# EAGLE design Mega2560 SX Shield (EAGLE 9.6.2)
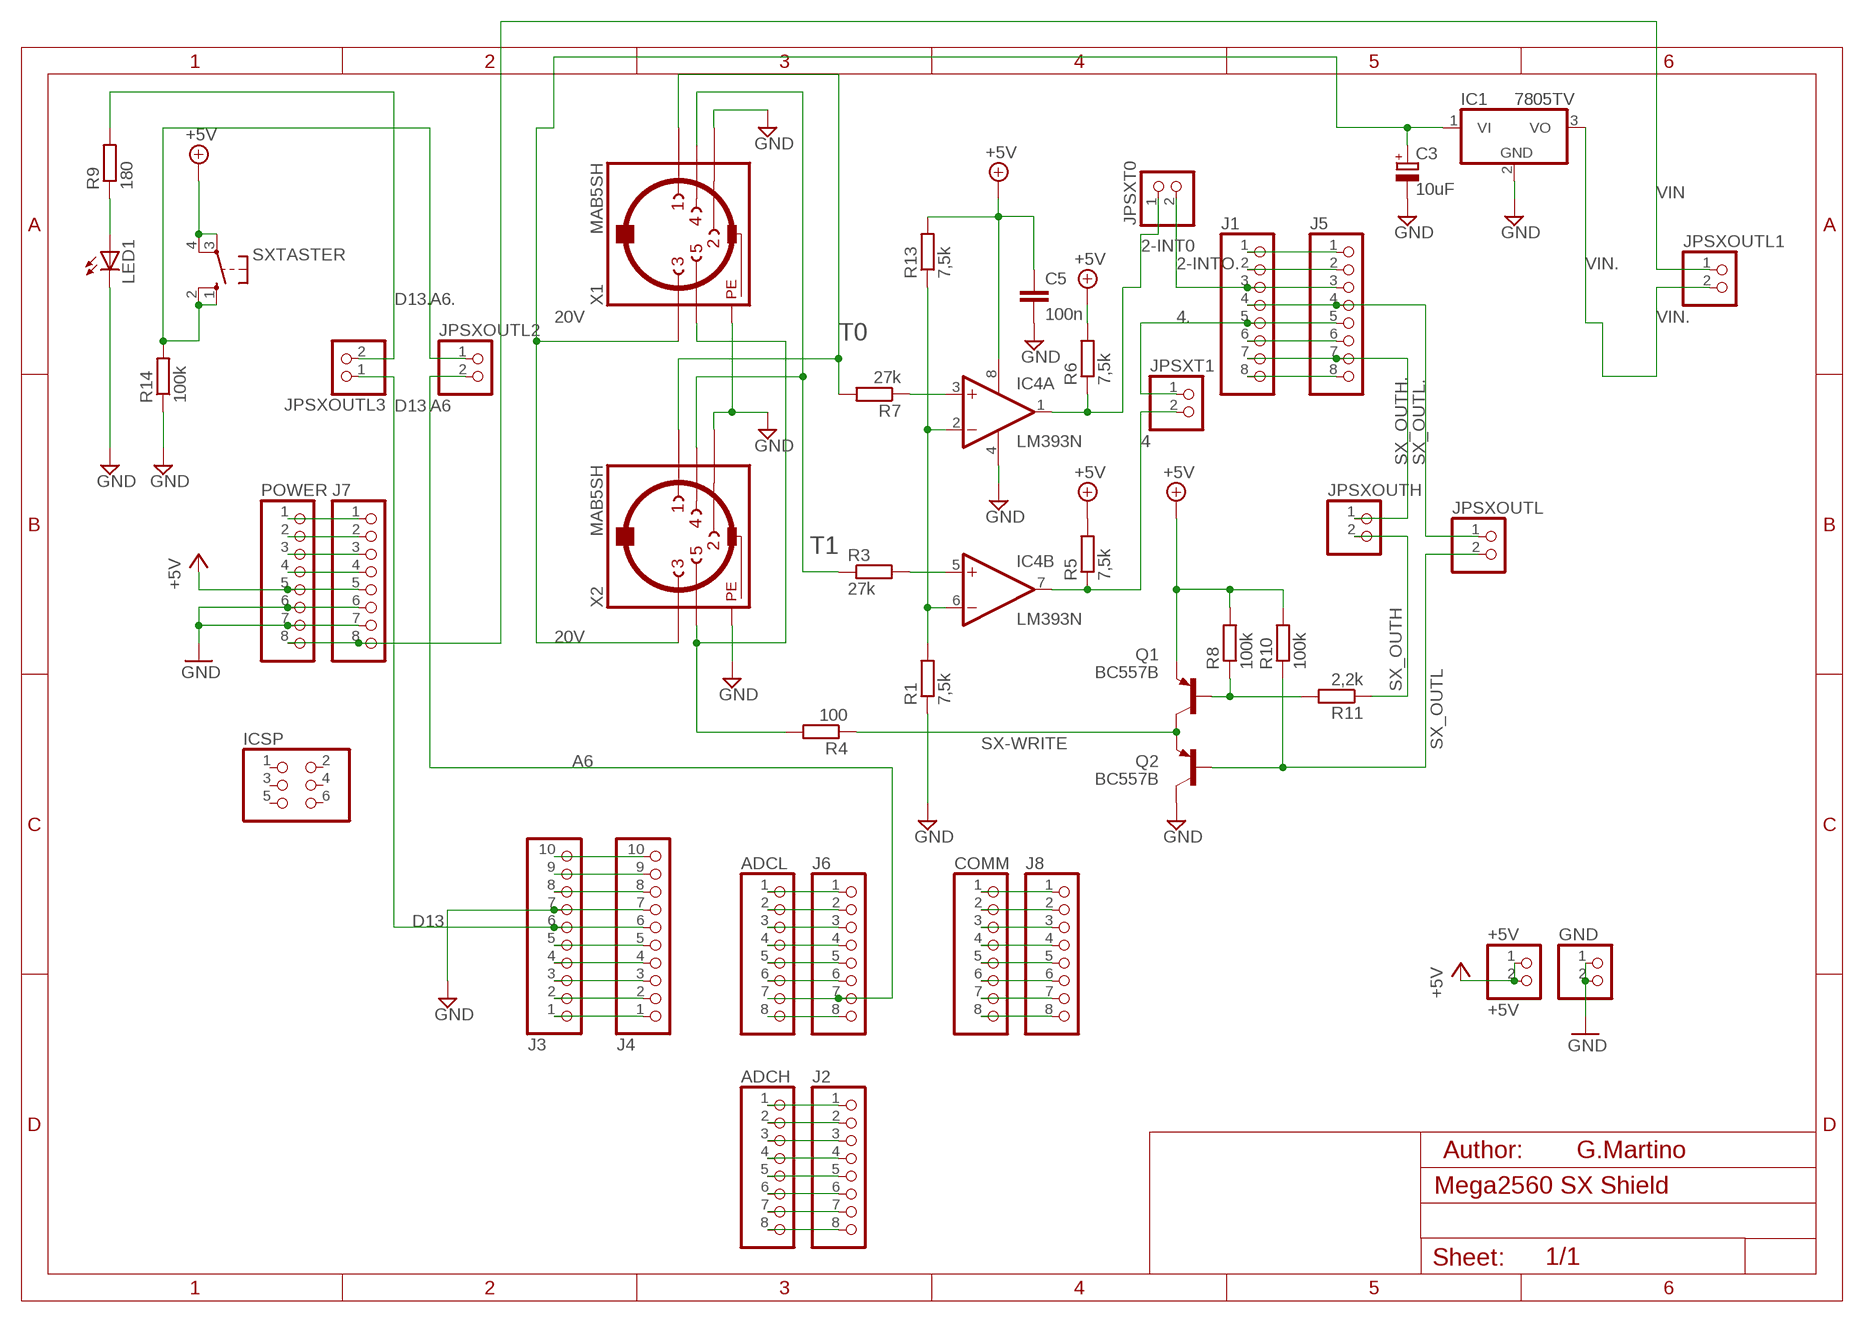
[diagram p0: schematic, sheet 1]

## Parts
+5V  +5V  PINHD-1X2  [1X02]
ADCH  PINHD-1X8TH  [1X08-TH]
ADCL  PINHD-1X8TH  [1X08-TH]
C3  10uF  CPOL-EUTT2D5  [TT2D5]
C5  100n  C-EU050-025X075  [C050-025X075]
COMM  PINHD-1X8TH  [1X08-TH]
GND  PINHD-1X2  [1X02]
IC1  7805TV  [TO220V]
IC4  LM393N  [DIL08]
ICSP  PINHD-2X3  [2X03]
J1  PINHD-1X8TH  [1X08-TH]
J2  PINHD-1X8TH  [1X08-TH]
J3  PINHD-1X10TH  [1X10-TH]
J4  PINHD-1X10TH  [1X10-TH]
J5  PINHD-1X8TH  [1X08-TH]
J6  PINHD-1X8TH  [1X08-TH]
J7  PINHD-1X8TH  [1X08-TH]
J8  PINHD-1X8TH  [1X08-TH]
JPSXOUTH  PINHD-1X2  [1X02]
JPSXOUTL  PINHD-1X2  [1X02]
JPSXOUTL1  PINHD-1X2  [1X02]
JPSXOUTL2  PINHD-1X2  [1X02]
JPSXOUTL3  PINHD-1X2  [1X02]
JPSXT0  PINHD-1X2  [1X02]
JPSXT1  PINHD-1X2  [1X02]
LED1  LED3MM  [LED3MM]
POWER  PINHD-1X8TH  [1X08-TH]
Q1  BC557B  [TO92-EBC]
Q2  BC557B  [TO92-EBC]
R1  7,5k  R-EU_0207/10  [0207/10]
R3  27k  R-EU_0207/10  [0207/10]
R4  100  R-EU_0207/10  [0207/10]
R5  7,5k  R-EU_0207/10  [0207/10]
R6  7,5k  R-EU_0207/10  [0207/10]
R7  27k  R-EU_0207/10  [0207/10]
R8  100k  R-EU_0207/10  [0207/10]
R9  180  R-EU_0207/10  [0207/10]
R10  100k  R-EU_0207/10  [0207/10]
R11  2,2k  R-EU_0207/10  [0207/10]
R13  7,5k  R-EU_0207/10  [0207/10]
R14  100k  R-EU_0207/10  [0207/10]
SXTASTER  10-XX  [B3F-10XX]
X1  MAB5SH  [MAB5SH]
X2  MAB5SH  [MAB5SH]

## Nets
2-INT0: IC4.1(A:OUT) JPSXT0.1 R6.1
2-INTO.: J1.3 J5.3 JPSXT0.2
4: IC4.7(B:OUT) JPSXT1.2 R5.1
4.: J1.5 J5.5 JPSXT1.1
20V: C3.+ IC1.1(VI) X1.3 X2.3
+5V: +5V.1 +5V.2 C5.1 IC4.8(P:V+) J7.5 POWER.5 Q1.E R5.2 R6.2 R8.2 R10.2 R13.2 SXTASTER.3(P) SXTASTER.4(P1)
A6: ADCL.7 J6.7 JPSXOUTL2.2
A6.: JPSXOUTL2.1 R14.2 SXTASTER.1(S) SXTASTER.2(S1)
D13: J3.6 J4.6 JPSXOUTL3.1
D13.: JPSXOUTL3.2 R9.2
GND: C3.- C5.2 GND.1 GND.2 IC1.2(GND) IC4.4(P:V-) J3.7 J4.7 J7.6 J7.7 LED1.K(C) POWER.6 POWER.7 Q2.C R1.1 R14.1 X1.2 X1.PE X1.PE@1(PE) X1.PE@2(PE) X1.PE@(PE) X2.2 X2.PE X2.PE@1(PE) X2.PE@2(PE) X2.PE@(PE)
N$1: IC4.3(A:+IN) R7.1
N$2: J3.1 J4.1
N$4: J1.2 J5.2
N$5: J3.4 J4.4
N$6: J3.2 J4.2
N$7: J3.3 J4.3
N$8: J1.1 J5.1
N$13: J1.6 J5.6
N$15: J1.8 J5.8
N$18: ADCL.1 J6.1
N$19: ADCL.2 J6.2
N$20: ADCL.3 J6.3
N$21: ADCL.4 J6.4
N$22: ADCL.5 J6.5
N$23: ADCL.6 J6.6
N$63: ADCL.8 J6.8
N$64: ADCH.1 J2.1
N$88: ADCH.2 J2.2
N$89: ADCH.3 J2.3
N$116: ADCH.4 J2.4
N$121: ADCH.5 J2.5
N$124: ADCH.6 J2.6
N$125: J7.4 POWER.4
N$126: J3.9 J4.9
N$127: ADCH.7 J2.7
N$128: ADCH.8 J2.8
N$129: COMM.1 J8.1
N$130: COMM.2 J8.2
N$133: COMM.3 J8.3
N$134: COMM.4 J8.4
N$136: COMM.5 J8.5
N$137: COMM.6 J8.6
N$138: COMM.7 J8.7
N$139: COMM.8 J8.8
N$140: J3.5 J4.5
N$219: J7.2 POWER.2
N$220: J7.1 POWER.1
N$222: J3.8 J4.8
N$223: J3.10 J4.10
N$338: IC4.5(B:+IN) R3.2
N$339: IC4.2(A:-IN) IC4.6(B:-IN) R1.2 R13.1
N$451: R4.2 X1.5 X2.5
N$452: LED1.A R9.1
N$481: Q1.B R8.1 R11.2
RESET: J7.3 POWER.3
SX-WRITE: Q1.C Q2.E R4.1
SX_OUTH: JPSXOUTH.2 R11.1
SX_OUTH.: J1.7 J5.7 JPSXOUTH.1
SX_OUTL: JPSXOUTL.2 Q2.B R10.1
SX_OUTL.: J1.4 J5.4 JPSXOUTL.1
T0: R7.2 X1.1 X2.1
T1: R3.1 X1.4 X2.4
VIN: J7.8 JPSXOUTL1.1 POWER.8
VIN.: IC1.3(VO) JPSXOUTL1.2
Unconnected: ICSP.1 ICSP.2 ICSP.3 ICSP.4 ICSP.5 ICSP.6

## Notes on the sheet
- G.Martino

## Library data of the parts
+5V GND JPSXOUTH JPSXOUTL JPSXOUTL1-JPSXOUTL3 JPSXT0 JPSXT1 = pinhead:PINHD-1X2: PIN HEADER
ADCH ADCL COMM J1 J2 J5-J8 POWER = Smartprj:PINHD-1X8: PIN HEADER
C3 = rcl:CPOL-EU: POLARIZED CAPACITOR, European symbol; SPICEPREFIX: C
C5 = rcl:C-EU: CAPACITOR, European symbol
IC1 = linear:78*: Positive VOLTAGE REGULATOR Source: http://cache.national.com/ds/LM/LM78L05.pdf http://www.fairchildsemi.com/ds/LM/LM7805.pdf
IC4 = linear:LM393: COMPARATOR
ICSP = Smartprj:PINHD-2X3: PIN HEADER
J3 J4 = Smartprj:PINHD-1X10: PIN HEADER
LED1 = led:LED: LED OSRAM: - CHIPLED LG R971, LG N971, LY N971, LG Q971, LY Q971, LO R971, LY R971 LH N974, LH R974 LS Q976, LO Q976, LY Q976 LO Q996 - Hyper CHIPLED LW Q18S LB Q993, LB Q99A, LB R99A - SideLED LS A670, LO A670, LY A670, LG A670, LP A670 LB A673, LV A673, LT A673, LW A673 LH A674 LY A675 LS A676, LA A676, LO A676, LY A676, LW A676 LS A679, LY A679, LG A679 - Hyper Micro SIDELED® LS Y876, LA Y876, LO Y876, LY Y876 LT Y87S - SmartLED LW L88C, LW L88S LB L89C, LB L89S, LG L890 LS L89K, LO L89K, LY L89K LS L896, LA L896, LO L896, LY L896 - TOPLED LS T670, LO T670, LY T670, LG T670, LP T670 LSG T670, LSP T670, LSY T670, LOP T670, LYG T670 LG T671, LOG T671, LSG T671 LB T673, LV T673, LT T673, LW T673 LH T674 LS T676, LA T676, LO T676, LY T676, LB T676, LH T676, LSB T676, LW T676 LB T67C, LV T67C, LT T67C, LS T67K, LO T67K, LY T67K, LW E67C LS E67B, LA E67B, LO E67B, LY E67B, LB E67C, LV E67C, LT E67C LW T67C LS T679, LY T679, LG T679 LS T770, LO T770, LY T770, LG T770, LP T770 LB T773, LV T773, LT T773, LW T773 LH T774 LS E675, LA E675, LY E675, LS T675 LS T776, LA T776, LO T776, LY T776, LB T776 LHGB T686 LT T68C, LB T68C - Hyper Mini TOPLED® LB M676 - Mini TOPLED Santana® LG M470 LS M47K, LO M47K, LY M47K Source: http://www.osram.convergy.de LUXEON: - LUMILED® LXK2-PW12-R00, LXK2-PW12-S00, LXK2-PW14-U00, LXK2-PW14-V00 LXK2-PM12-R00, LXK2-PM12-S00, LXK2-PM14-U00 LXK2-PE12-Q00, LXK2-PE12-R00, LXK2-PE12-S00, LXK2-PE14-T00, LXK2-PE14-U00 LXK2-PB12-K00, LXK2-PB12-L00, LXK2-PB12-M00, LXK2-PB14-N00, LXK2-PB14-P00, LXK2-PB14-Q00 LXK2-PR12-L00, LXK2-PR12-M00, LXK2-PR14-Q00, LXK2-PR14-R00 LXK2-PD12-Q00, LXK2-PD12-R00, LXK2-PD12-S00 LXK2-PH12-R00, LXK2-PH12-S00 LXK2-PL12-P00, LXK2-PL12-Q00, LXK2-PL12-R00 Source: www.luxeon.com KINGBRIGHT: KA-3528ASYC Source: www.kingbright.com
Q1 Q2 = transistor-pnp:BC557*: PNP Transistror
R1 R4-R11 R13 R14 = rcl:R-EU_: RESISTOR, European symbol; SPICEPREFIX: R
R3 = rcl:R-EU_: RESISTOR, European symbol
SXTASTER = switch-omron:10-XX: OMRON SWITCH; MPN: B3F-1000; OC_FARNELL: 176432; OC_NEWARK: 36M3542
X1 X2 = con-hirschmann_Tha:MAB5SH: Female CONNECTOR 5 pins 90 deg. with shield, horizontal (DIN 41524); OC_FARNELL: 809883; OC_NEWARK: unknown

## Board
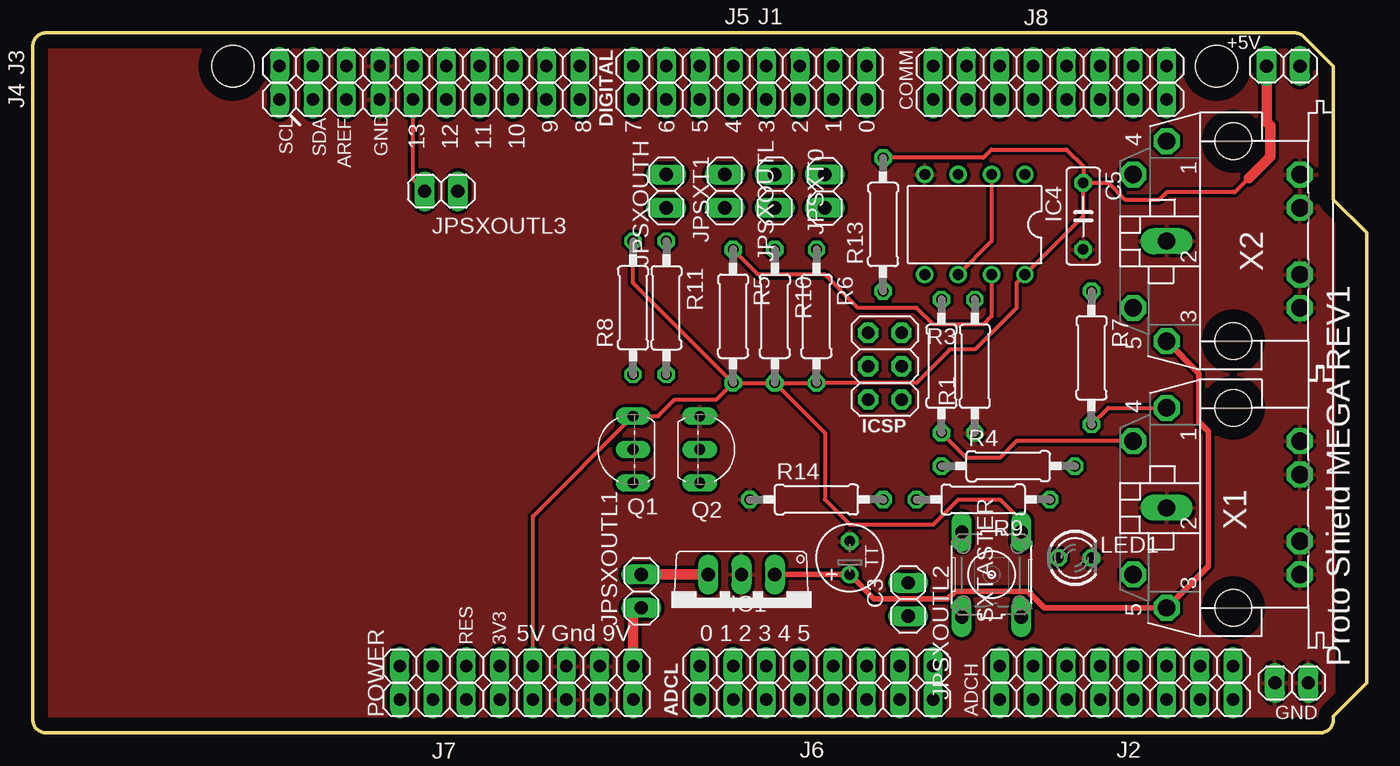
[diagram p1: board, top side]
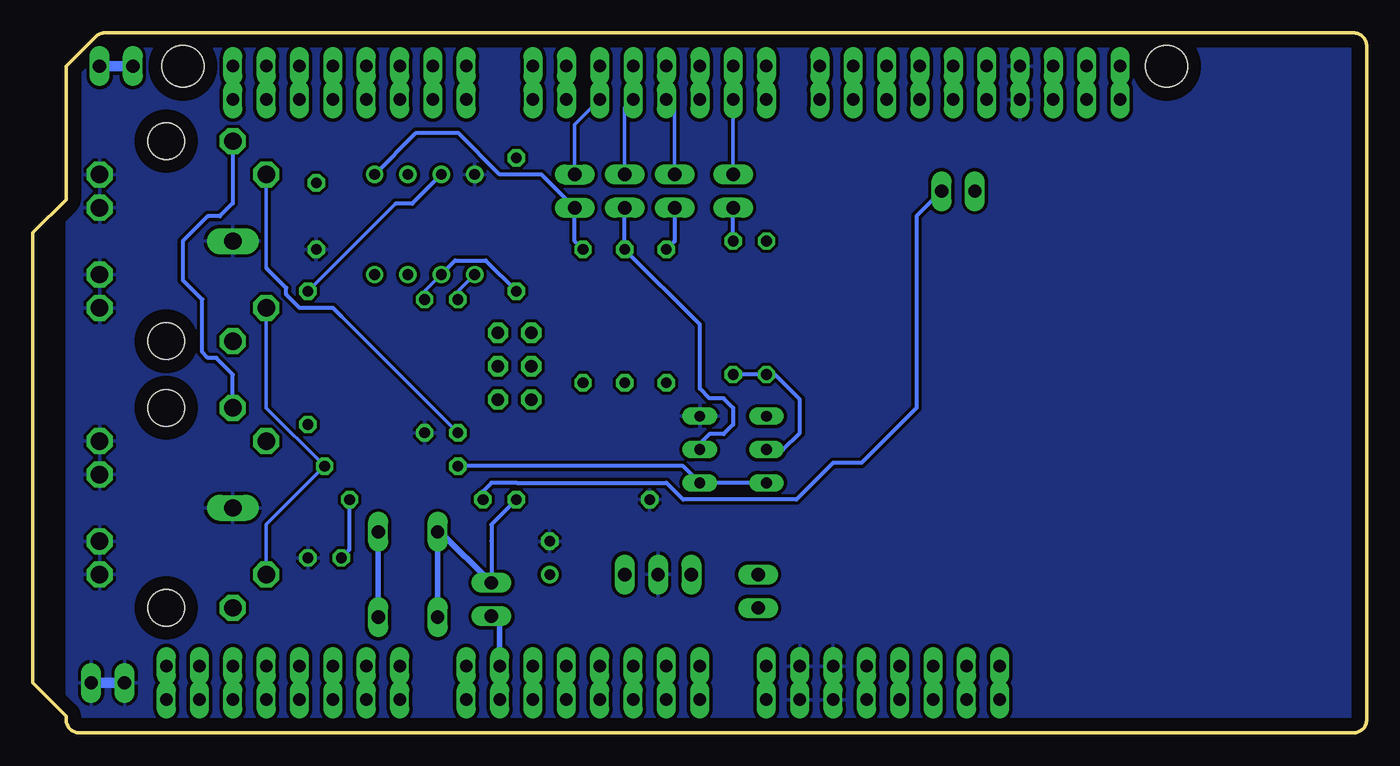
[diagram p2: board, bottom side, seen from below]

Size 101.6 x 53.34 mm. Coordinates in mm from the lower left corner, seen from the top.
Outline: 99.06,40.64 101.6,38.1 101.6,3.81 99.06,1.27 99.06,1 arc-90 98.06,0 1,0 arc-90 0,1 0,52.34 arc-90 1,53.34 96.11,53.34 arc-45 96.81,53.05 99.06,50.8 99.06,40.64
Copper layers (1*16): Top 0.035mm / dielectric 1.5mm / Bottom 0.035mm
Design rules "platinenbelichter": minimum track width 10mil, minimum drill 24mil, track to track 10mil, track to pad 10mil, pad to pad 10mil, via to via 10mil, smd to smd 10mil, copper to edge 40mil, drill to drill 8mil, minimum pad ring 10mil, minimum via ring 8mil, stop-mask expansion 10mil, vias tented up to drill 0mil, thermal gap 10mil
Holes 3.2 mm at 15.24,50.8 90.17,50.8

### Footprints (pad centres in the part's own frame; a part is rotated, then mirrored left to right if it is on the bottom)
1X02 = drill 1.016 long: 1 -1.27,0; 2 1.27,0
1X08-TH = drill 0.95 pad 1.422 long: 1 -8.89,0; 2 -6.35,0; 3 -3.81,0; 4 -1.27,0; 5 1.27,0; 6 3.81,0; 7 6.35,0; 8 8.89,0
TT2D5 = drill 0.813: + -1.27,0 | drill 0.813 octagon: - 1.27,0
C050-025X075 = drill 0.813 octagon: 1 -2.54,0; 2 2.54,0
TO220V = drill 1.016 long: 1 -2.54,-2.54; 2 0,-2.54; 3 2.54,-2.54
DIL08 = drill 0.813 pad 1.27: 1 -3.81,-3.81; 2 -1.27,-3.81; 3 1.27,-3.81; 4 3.81,-3.81; 5 3.81,3.81; 6 1.27,3.81; 7 -1.27,3.81; 8 -3.81,3.81
2X03 = drill 0.95 pad 1.55 octagon: 1 -2.54,-1.27; 2 -2.54,1.27; 3 0,-1.27; 4 0,1.27; 5 2.54,-1.27; 6 2.54,1.27
1X10-TH = drill 0.95 pad 1.422 long: 1 -11.43,0; 2 -8.89,0; 3 -6.35,0; 4 -3.81,0; 5 -1.27,0; 6 1.27,0; 7 3.81,0; 8 6.35,0; 9 8.89,0; 10 11.43,0
LED3MM = drill 0.813 octagon: A -1.27,0; K 1.27,0
TO92-EBC = drill 0.813 long: B 0,-1.27; C -2.54,-1.27; E 2.54,-1.27
0207/10 = drill 0.813 octagon: 1 -5.08,0; 2 5.08,0
B3F-10XX = drill 1.016 long: 1 -3.251,2.261; 2 3.251,2.261; 3 -3.251,-2.261; 4 3.251,-2.261
MAB5SH = drill 1.321 octagon: 1 7.62,5.08; 3 -7.62,5.08; 4 5.08,7.62; 5 -5.08,7.62; PE -2.54,-5.08; PE@ 2.54,-5.08; PE@1 -5.08,-5.08; PE@2 5.08,-5.08 | drill 1.321 long: 2 0,5.08 | hole 2.794: 7.62,0; -7.62,0

### Placement (x,y rotation side)
+5V  95.25,50.8 0 top
ADCH  82.55,2.54 0 top
ADCL  59.69,2.54 0 top
C3  62.23,13.34 90 top
C5  80.01,39.37 270 top
COMM  77.47,50.8 0 top
GND  95.89,3.81 0 top
IC1  53.98,9.53 180 top
IC4  71.75,38.73 180 top
ICSP  64.9,27.94 270 top
J1  54.61,50.8 180 top
J2  82.55,5.08 0 top
J3  30.23,50.8 180 top
J4  30.23,48.26 180 top
J5  54.61,48.26 180 top
J6  59.69,5.08 0 top
J7  36.83,2.54 0 top
J8  77.47,48.26 0 top
JPSXOUTH  48.26,41.27 270 top
JPSXOUTL  56.52,41.27 270 top
JPSXOUTL1  46.35,10.79 90 top
JPSXOUTL2  66.67,10.16 270 top
JPSXOUTL3  31.11,41.27 0 top
JPSXT0  60.33,41.27 90 top
JPSXT1  52.7,41.27 270 top
LED1  79.38,13.34 0 top
POWER  36.83,5.08 0 top
Q1  44.45,21.59 90 top
Q2  52.07,21.59 270 top
R1  71.75,27.94 90 top
R3  69.22,27.94 90 top
R4  74.3,20.32 0 top
R5  53.34,31.75 270 top
R6  59.69,31.75 270 top
R7  80.64,28.57 270 top
R8  45.72,32.38 90 top
R9  72.39,17.78 180 top
R10  56.52,31.75 270 top
R11  48.26,32.38 270 top
R13  64.77,38.73 90 top
R14  59.69,17.78 0 top
SXTASTER  73.03,12.06 90 top
X1  91.44,17.14 90 top
X2  91.44,37.47 90 top

### Tracks (layer width: path | path; a pad name or v marks a point on that pad's centre or on a via)
2-INT0
  Bottom 0.305: R6.1 60.33,37.47 JPSXT0.1 62.87,42.55 66.04,42.55 69.22,45.72 72.39,45.72 IC4.1
2-INTO.
  Bottom 0.254: J5.3 60.33,46.35 JPSXT0.2
  Bottom 0.61: J5.3 J1.3
4
  Top 0.305: R5.1 55.24,34.92 60.33,34.92 62.87,32.38 67.31,32.38 68.58,31.11 72.39,31.11 73.03,31.75 IC4.7
  Bottom 0.305: JPSXT1.2 52.7,37.47 R5.1
4.
  Bottom 0.254: JPSXT1.1 52.7,47.62 J5.5
  Bottom 0.61: J5.5 J1.5
20V
  Top 0.406: X2.3 88.82,27.38 88.82,23.68 89.53,22.97 89.53,12.7 X1.3 77.06,9.53 75.79,10.79 70.26,10.79 69.67,10.21 64.08,10.21 C3.+ IC1.1
+5V
  Top 0.305: R5.2 R10.2 | R10.2 R6.2 67.31,26.67 69.85,29.21 71.75,29.21 74.93,32.38 74.93,34.29 IC4.8 80.01,39.37 C5.1 | R5.2 52.07,25.4 48.9,25.4 47.62,24.13 Q1.E 38.1,16.51 POWER.5 | C5.1 81.92,41.91 83.19,40.64 85.8,40.64 86.36,41.2 91.54,41.2 92.61,42.27 | R13.2 72.39,43.81 73.03,44.45 78.74,44.45 80.01,43.18 C5.1 | R10.2 60.33,22.86 60.33,17.78 62.23,15.88 68.58,15.88 70.48,17.78 73.66,17.78 75.29,16.15 SXTASTER.4 | R5.2 45.72,34.29 R8.2
  Top 0.813: 92.61,42.27 94.26,43.92 94.26,46.25 93.98,46.53 +5V.1
  Bottom 0.406: SXTASTER.3 SXTASTER.4
  Bottom 0.813: POWER.5 J7.5 | +5V.1 +5V.2
A6
  Bottom 0.406: J6.7 66.04,8.26 JPSXOUTL2.2
  Bottom 0.61: ADCL.7 J6.7
A6.
  Bottom 0.305: R14.2 66.67,15.88 66.67,14.61 JPSXOUTL2.1
  Bottom 0.406: JPSXOUTL2.1 70.56,15.32 SXTASTER.2 SXTASTER.1
D13
  Top 0.305: JPSXOUTL3.1 28.96,42.16 J4.6
  Bottom 0.61: J4.6 J3.6
D13.
  Bottom 0.305: JPSXOUTL3.2 34.29,39.37 34.29,24.77 38.48,20.57 40.64,20.57 43.43,17.78 52.07,17.78 53.34,19.05 64.77,19.05 66.67,19.05 67.31,18.41 R9.2
GND
  Bottom 0.61: POWER.6 J7.6 | POWER.7 J7.7 | J4.7 J3.7
  Bottom 0.813: GND.1 GND.2
  pour Bottom: 0.64,53.34 95.89,53.34 99.06,50.16 99.06,40.64 99.06,1.27 97.79,0 0,0 0,52.7
  pour Top: 1.27,52.7 96.52,52.7 99.06,50.16 99.06,2.54 99.06,1.27 98.42,0.64 1.91,0.64 1.27,1.27
N$1
  Bottom 0.254: R7.1 73.98,40.32
  Bottom 0.305: 73.98,40.32 72.71,40.32 IC4.3
N$2
  Bottom 0.61: J4.1 J3.1
N$4
  Bottom 0.61: J5.2 J1.2
N$5
  Bottom 0.61: J4.4 J3.4
N$6
  Bottom 0.61: J4.2 J3.2
N$7
  Bottom 0.61: J4.3 J3.3
N$8
  Bottom 0.61: J5.1 J1.1
N$13
  Bottom 0.61: J5.6 J1.6
N$15
  Bottom 0.61: J5.8 J1.8
N$18
  Bottom 0.61: ADCL.1 J6.1
N$19
  Bottom 0.61: ADCL.2 J6.2
N$20
  Bottom 0.61: ADCL.3 J6.3
N$21
  Bottom 0.61: ADCL.4 J6.4
N$22
  Bottom 0.61: ADCL.5 J6.5
N$23
  Bottom 0.61: ADCL.6 J6.6
N$63
  Bottom 0.61: ADCL.8 J6.8
N$64
  Bottom 0.61: ADCH.1 J2.1
N$88
  Bottom 0.61: ADCH.2 J2.2
N$89
  Bottom 0.61: ADCH.3 J2.3
N$116
  Bottom 0.61: ADCH.4 J2.4
N$121
  Bottom 0.61: ADCH.5 J2.5
N$124
  Bottom 0.61: ADCH.6 J2.6
N$125
  Bottom 0.61: J7.4 POWER.4
N$126
  Bottom 0.61: J4.9 J3.9
N$127
  Bottom 0.61: ADCH.7 J2.7
N$128
  Bottom 0.61: ADCH.8 J2.8
N$129
  Bottom 0.61: J8.1 COMM.1
N$130
  Bottom 0.61: J8.2 COMM.2
N$133
  Bottom 0.61: J8.3 COMM.3
N$134
  Bottom 0.61: J8.4 COMM.4
N$136
  Bottom 0.61: J8.5 COMM.5
N$137
  Bottom 0.61: J8.6 COMM.6
N$138
  Bottom 0.61: J8.7 COMM.7
N$139
  Bottom 0.61: J8.8 COMM.8
N$140
  Bottom 0.61: J4.5 J3.5
N$219
  Bottom 0.61: J7.2 POWER.2
N$220
  Bottom 0.61: J7.1 POWER.1
N$222
  Bottom 0.61: J4.8 J3.8
N$223
  Bottom 0.61: J4.10 J3.10
N$338
  Bottom 0.254: IC4.5 69.22,33.66 R3.2
N$339
  Top 0.305: IC4.6 73.03,37.47 IC4.2
  Bottom 0.254: IC4.6 71.75,33.66 R1.2
  Bottom 0.305: IC4.6 69.42,35.99 67.11,35.99 R13.1
N$451
  Bottom 0.254: X2.5 83.82,24.77 R4.2 83.82,15.88 X1.5
N$452
  Bottom 0.305: LED1.A 77.47,13.97 R9.1
N$481
  Bottom 0.305: Q1.B 44.45,21.59 43.18,22.86 43.18,25.4 45.09,27.3 R8.1 R11.2
RESET
  Bottom 0.61: POWER.3 J7.3
SX-WRITE
  Bottom 0.305: Q1.C Q2.E 52.07,20.32 R4.1
SX_OUTH
  Bottom 0.305: R11.1 JPSXOUTH.2
SX_OUTH.
  Bottom 0.254: JPSXOUTH.1 J5.7
  Bottom 0.61: J5.7 J1.7
SX_OUTL
  Bottom 0.305: JPSXOUTL.2 R10.1 50.8,31.11 50.8,26.23 50.07,25.5 48.99,25.5 48.26,24.77 48.26,23.5 48.99,22.76 50.07,22.76 50.8,22.03 Q2.B
SX_OUTL.
  Bottom 0.254: JPSXOUTL.1 56.52,47.62 J5.4
  Bottom 0.61: J5.4 J1.4
T0
  Top 0.305: R7.2 81.92,24.77 X1.1
  Bottom 0.305: X2.1 86.36,40.36 87.35,39.37 88.27,39.37 90.17,37.47 90.17,34.49 88.7,33.02 88.7,29.01 88.27,28.57 87.63,28.57 86.36,27.3 X1.1
T1
  Top 0.305: X1.4 74.93,22.23 73.66,20.95 71.12,20.95 R3.1
  Bottom 0.254: R3.1 78.11,31.75 | 83.82,35.43 X2.4
  Bottom 0.305: 78.11,31.75 78.74,32.38 81.28,32.38 82.3,33.4 82.3,33.91 83.82,35.43
VIN
  Top 0.813: POWER.8 45.72,8.89 JPSXOUTL1.1
  Bottom 0.61: J7.8 POWER.8
VIN.
  Top 0.813: JPSXOUTL1.2 IC1.3

### Text on the board
tPlace: 9 | 8 | 7 | 6 | 5 | 4 | 3 | 2 | 1 | 0 | 13 | 12 | 11 | 10 | Proto Shield MEGA REV1
tNames: DIGITAL | SCL | SDA | AREF | GND | RES | 3V3 | 5V Gnd 9V | 0 1 2 3 4 5
bStop: DIGITAL | COMM | 5V | SCL | SDA | AREF | GND | 13 | 12 | 11 | 10 | 9 | 8 | 6 | 5 | 4 | 3 | 2 | 1 | 0 | TX3 | RX3 | TX2 | RX2 | TX1 | RX1 | SDA | SCL | 31 | 33 | 35 | 37 | 39 | 41 | 43 | 45 | 47 | 49 | 51 | 53 | IOREF | RST | 3.3V | 5V | GND | GND | VIN | 0 | 1 | 2 | 3 | 4 | 5 | 7 | 8 | 9 | 10 | 11 | 12 | 13 | 14 | 15 | ANALOG | ANALOG | GND